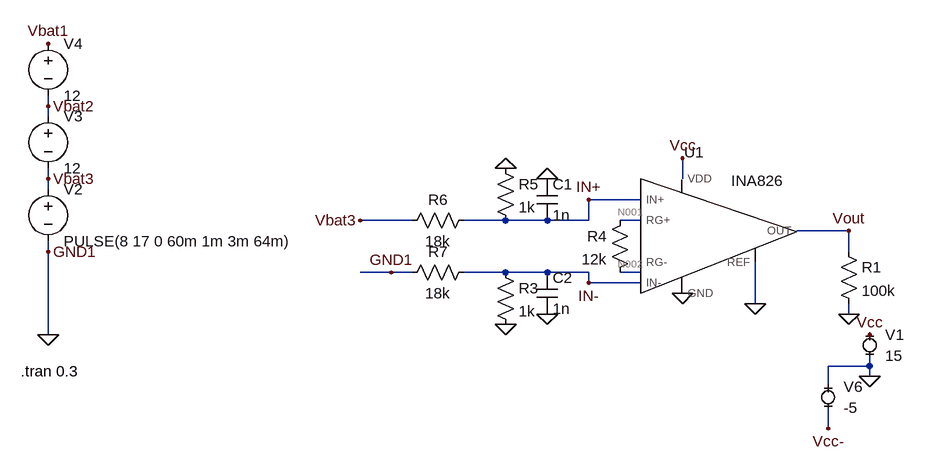
[diagram p0: schematic INA826.asc]
INA826.asc, the LTspice schematic file:
Version 4
SHEET 1 1152 704
WIRE -480 112 -480 96
WIRE -480 128 -480 112
WIRE -480 224 -480 208
WIRE 496 224 496 192
WIRE -480 240 -480 224
WIRE 432 256 352 256
WIRE 80 288 0 288
WIRE 224 288 160 288
WIRE 288 288 224 288
WIRE 352 288 352 256
WIRE 352 288 288 288
WIRE 432 288 400 288
WIRE 752 304 672 304
WIRE -480 336 -480 320
WIRE 752 336 752 304
WIRE 48 368 0 368
WIRE 80 368 48 368
WIRE 224 368 160 368
WIRE 288 368 224 368
WIRE 352 368 288 368
WIRE 432 368 432 352
WIRE 432 368 400 368
WIRE 352 384 352 368
WIRE 432 384 352 384
WIRE 608 416 608 352
WIRE 752 432 752 416
WIRE -480 464 -480 336
WIRE 784 512 784 496
WIRE 784 512 720 512
WIRE 784 528 784 512
WIRE 720 544 720 512
WIRE 720 608 720 576
FLAG 784 464 Vcc
FLAG 784 528 0
FLAG -480 224 Vbat3
FLAG 0 288 Vbat3
FLAG 496 192 Vcc
FLAG 752 432 0
FLAG 352 256 IN+
FLAG 352 384 IN-
FLAG 752 304 Vout
FLAG -480 16 Vbat1
FLAG -480 112 Vbat2
FLAG -480 464 0
FLAG -480 336 GND1
FLAG 48 368 GND1
FLAG 720 608 Vcc-
FLAG 608 416 0
FLAG 224 208 0
FLAG 224 448 0
FLAG 496 400 0
FLAG 288 224 0
FLAG 288 432 0
SYMBOL MiniSyms4\\voltage- 784 480 R0
WINDOW 123 0 0 Left 0
WINDOW 39 0 0 Left 0
SYMATTR InstName V1
SYMATTR Value 15
SYMBOL voltage -480 224 R0
WINDOW 123 0 0 Left 0
WINDOW 39 0 0 Left 0
SYMATTR InstName V2
SYMATTR Value PULSE(8 17 0 60m 1m 3m 64m)
SYMBOL voltage -480 112 R0
WINDOW 123 0 0 Left 0
WINDOW 39 0 0 Left 0
SYMATTR InstName V3
SYMATTR Value 12
SYMBOL voltage -480 0 R0
WINDOW 123 0 0 Left 0
WINDOW 39 0 0 Left 0
SYMATTR InstName V4
SYMATTR Value 12
SYMBOL res 176 272 R90
WINDOW 0 0 56 VBottom 2
WINDOW 3 32 56 VTop 2
SYMATTR InstName R6
SYMATTR Value 18k
SYMBOL res 176 352 R90
WINDOW 0 0 56 VBottom 2
WINDOW 3 32 56 VTop 2
SYMATTR InstName R7
SYMATTR Value 18k
SYMBOL res 736 320 R0
SYMATTR InstName R1
SYMATTR Value 100k
SYMBOL INA826 528 320 R0
SYMATTR InstName U1
SYMBOL res 416 272 M0
SYMATTR InstName R4
SYMATTR Value 12k
SYMBOL MiniSyms4\\voltage- 720 560 R0
WINDOW 123 0 0 Left 0
WINDOW 39 0 0 Left 0
SYMATTR InstName V6
SYMATTR Value -5
SYMBOL res 208 352 R0
SYMATTR InstName R3
SYMATTR Value 1k
SYMBOL res 208 192 R0
SYMATTR InstName R5
SYMATTR Value 1k
SYMBOL cap 272 224 R0
SYMATTR InstName C1
SYMATTR Value 1n
SYMBOL cap 272 368 R0
SYMATTR InstName C2
SYMATTR Value 1n
TEXT -522 520 Left 2 !.tran 0.3

The netlist it stands for:
* INA826.asc
V1 Vcc 0 15
V2 Vbat3 0 PULSE(8 17 0 60m 1m 3m 64m)
V3 Vbat2 Vbat3 12
V4 Vbat1 Vbat2 12
R6 IN+ Vbat3 18k
R7 IN- 0 18k
R1 Vout 0 100k
XU1 IN+ IN- Vcc 0 Vout 0 N002 N001 INA826  ; pins IN+ IN- VDD GND OUT REF RG- RG+
R4 N001 N002 12k
V6 0 Vcc- -5
R3 IN- 0 1k
R5 0 IN+ 1k
C1 0 IN+ 1n
C2 IN- 0 1n
.tran 0.3
.lib C:\users\alejopm\Favorites\alejopm\zenite\MSC22\simulations\INA826.lib
.backanno
.end

* Results of the author's LTspice run, read from the files saved beside the schematic
* Operating Point, zero values left out:
*   V(vcc) = 15 V
*   V(vbat3) = 8 V
*   V(vbat2) = 20 V
*   V(vbat1) = 32 V
*   V(in+) = 421.1 mV
*   V(in-) = 28.74 µV
*   V(vout) = 2.14 V
*   V(n002) = 720.1 mV
*   V(n001) = 1.14 V
*   V(vcc-) = 5 V
*   I(R5) = -421.1 µA
*   I(R3) = 28.74 nA
*   I(R4) = 34.99 µA
*   I(R1) = 21.4 µA
*   I(R7) = 1.597 nA
*   I(R6) = -421.1 µA
*   I(V2) = -421.1 µA
*   I(V1) = -274.8 µA
*   Ix(u1:IN+) = -28.35 nA
*   Ix(u1:IN-) = -30.33 nA
*   Ix(u1:VDD) = 274.8 µA
*   Ix(u1:GND) = -231.8 µA
*   Ix(u1:OUT) = -21.4 µA
*   Ix(u1:REF) = -21.52 µA
*   Ix(u1:RG-) = 34.99 µA
*   Ix(u1:RG+) = -34.99 µA
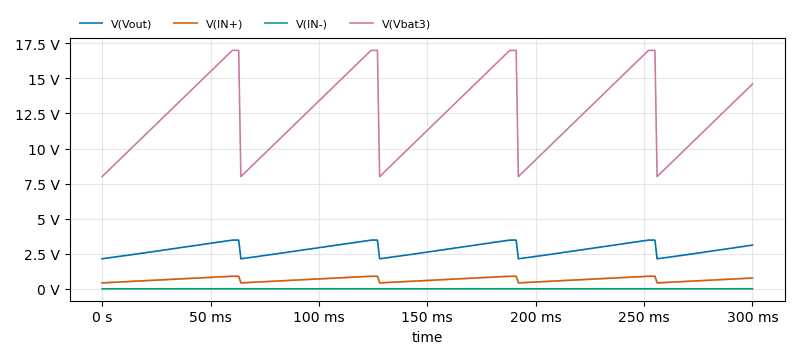
[diagram p1: Transient Analysis of INA826.asc, plotted from the saved traces]
* Transient Analysis, 1 run:
*   V(Vout): min 2.14 V, max 3.47 V, average 2.801 V, rms 2.829 V, last 3.117 V
*   V(IN+): min 421.1 mV, max 894.8 mV, average 658.1 mV, rms 673.1 mV, last 768.4 mV
*   V(IN-): min 28.47 µV, max 2.592 mV, average 378.9 µV, rms 775.8 µV, last 175.8 µV
*   V(Vbat3): min 8 V, max 17 V, average 12.5 V, rms 12.79 V, last 14.6 V